# Altium schematic sheet word clock.SchDoc
size 533 x 457 mm
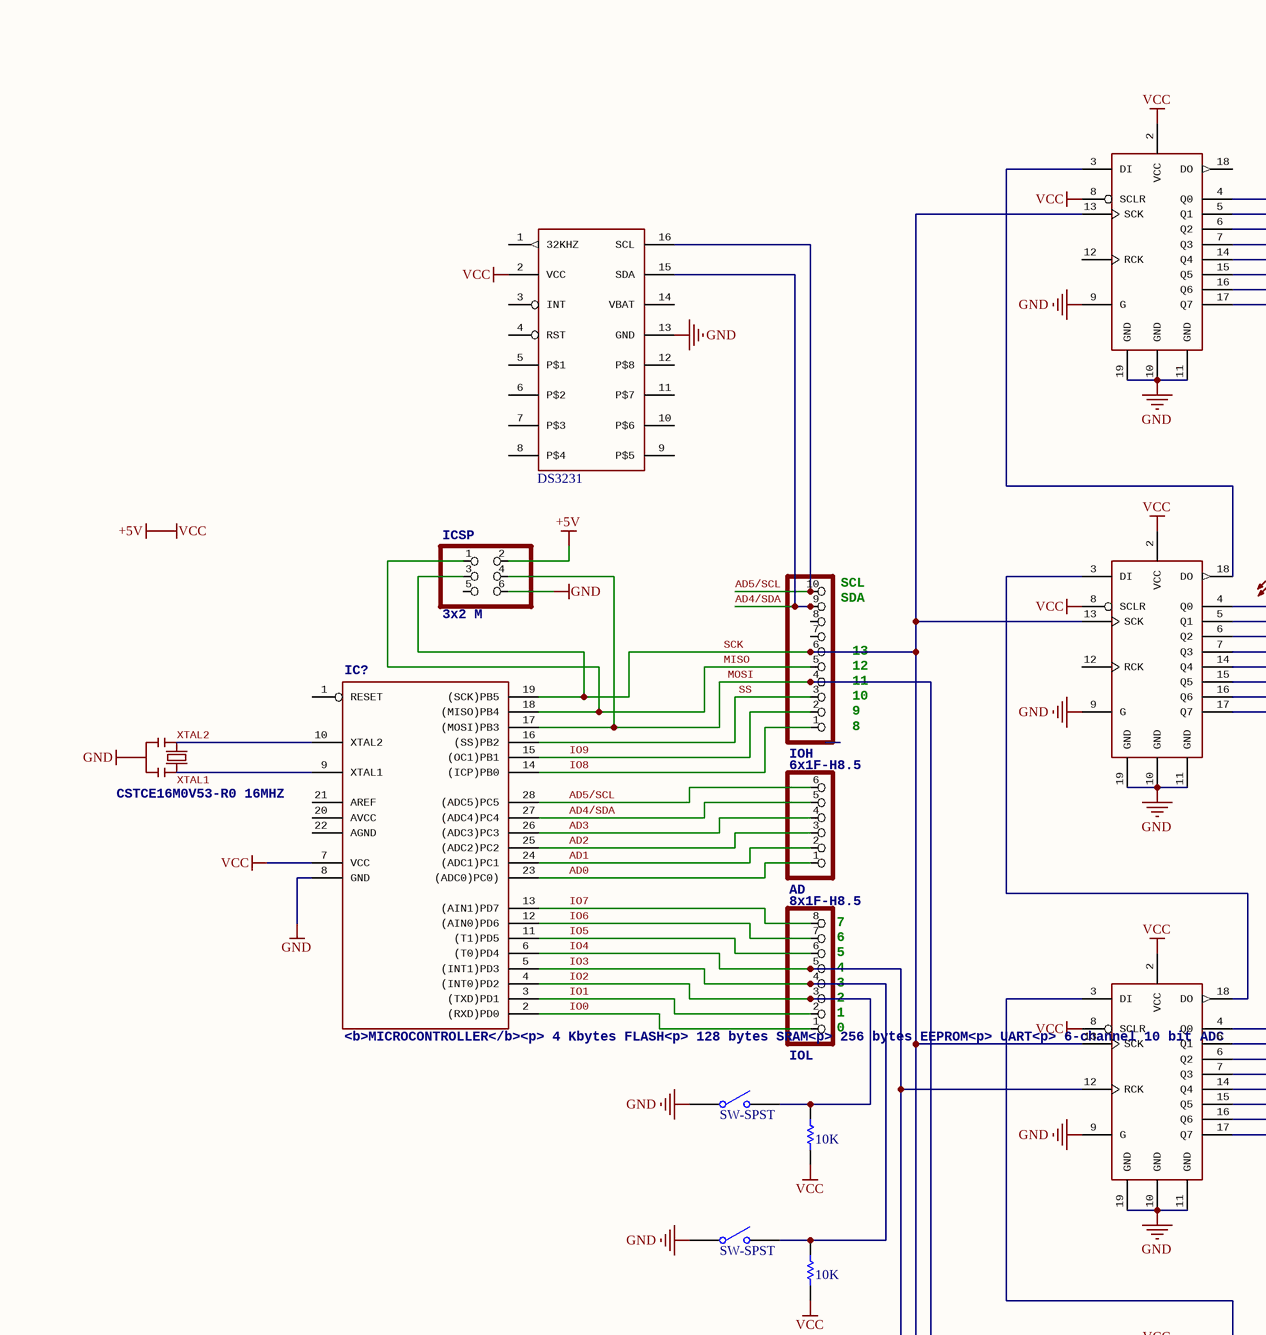
[diagram p0: word clock.SchDoc, top left]
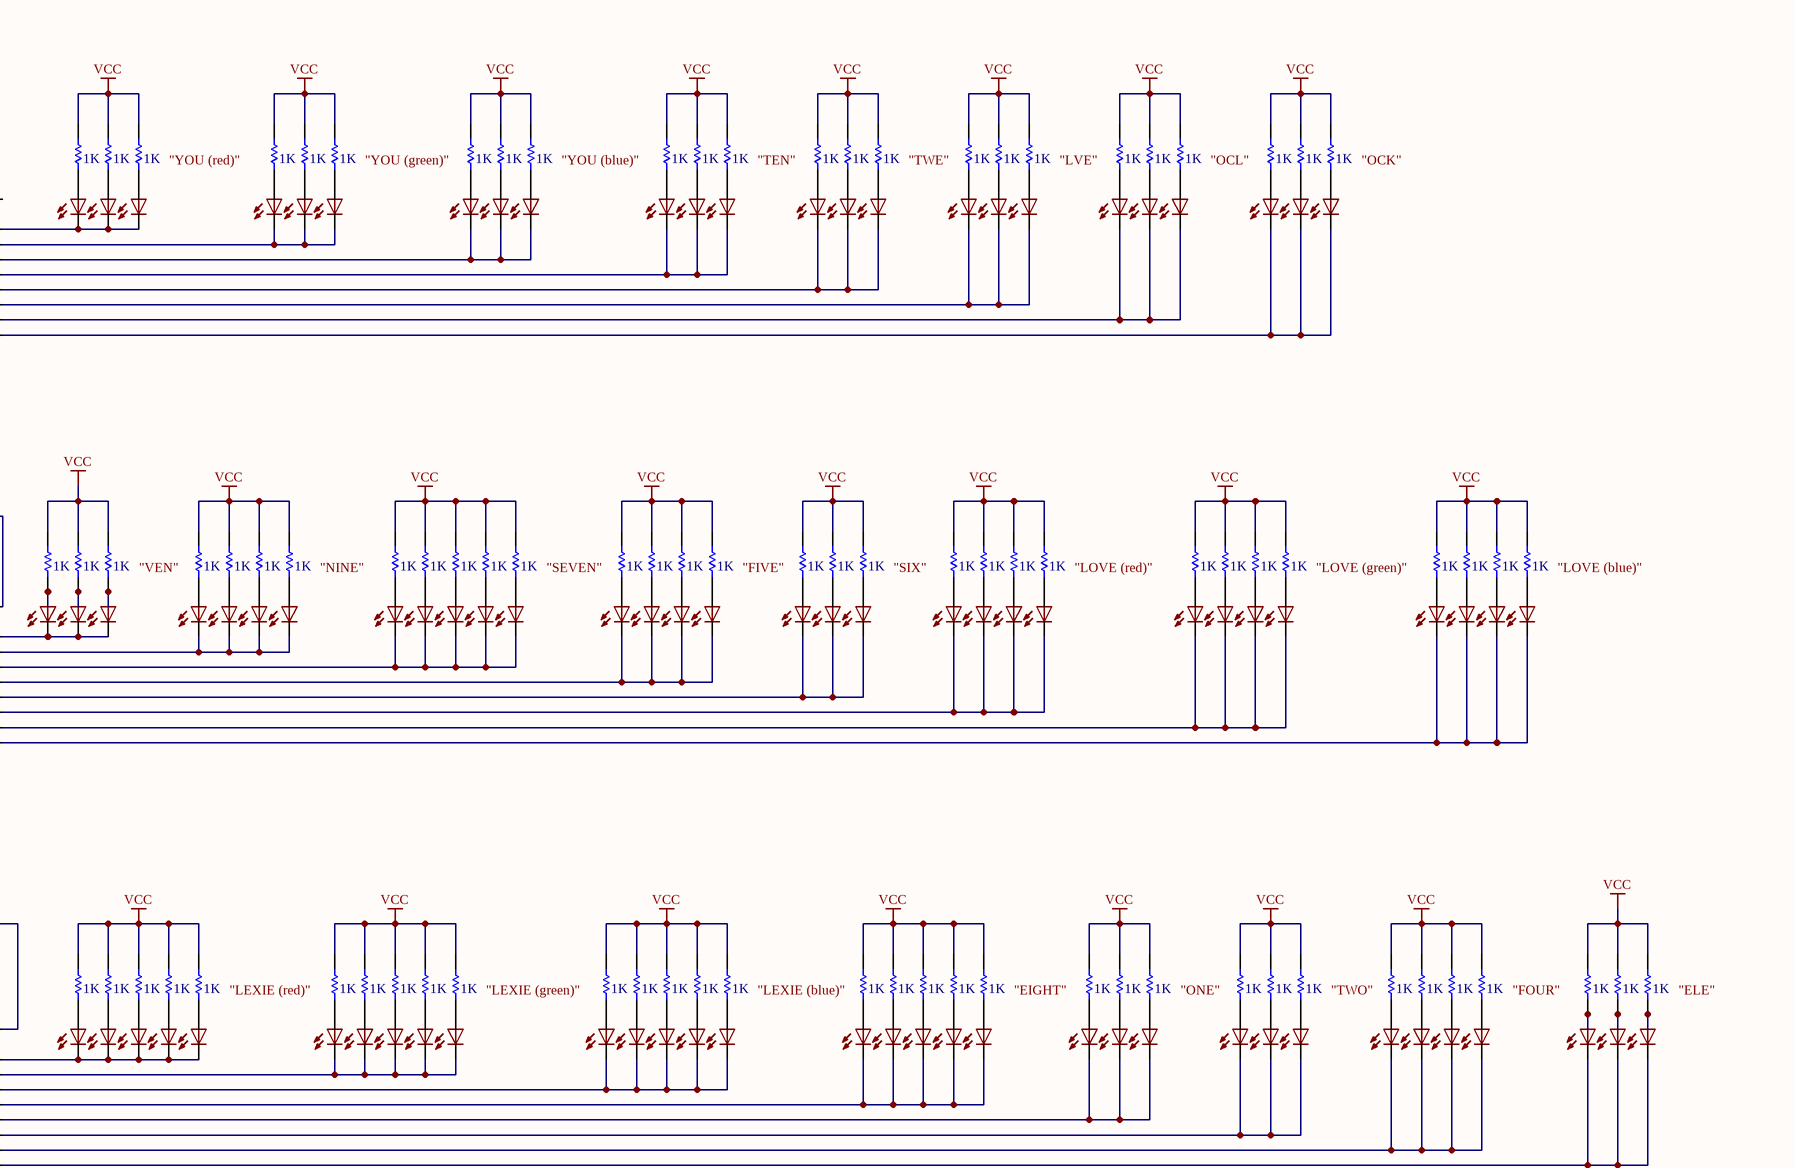
[diagram p1: word clock.SchDoc, top right]
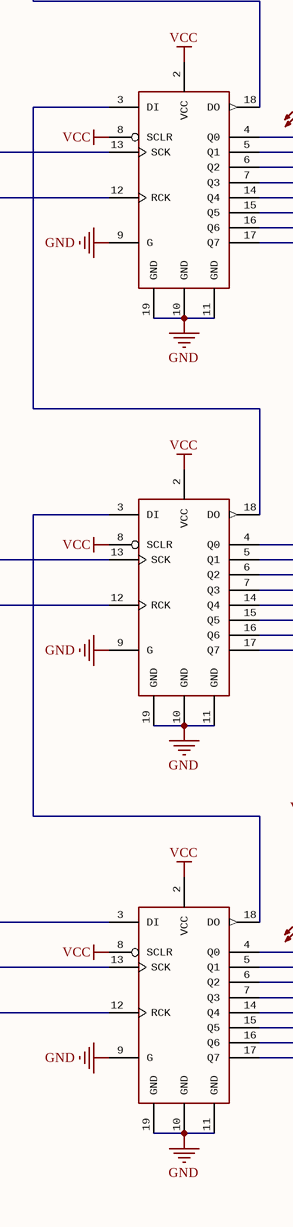
[diagram p2: word clock.SchDoc, bottom left]
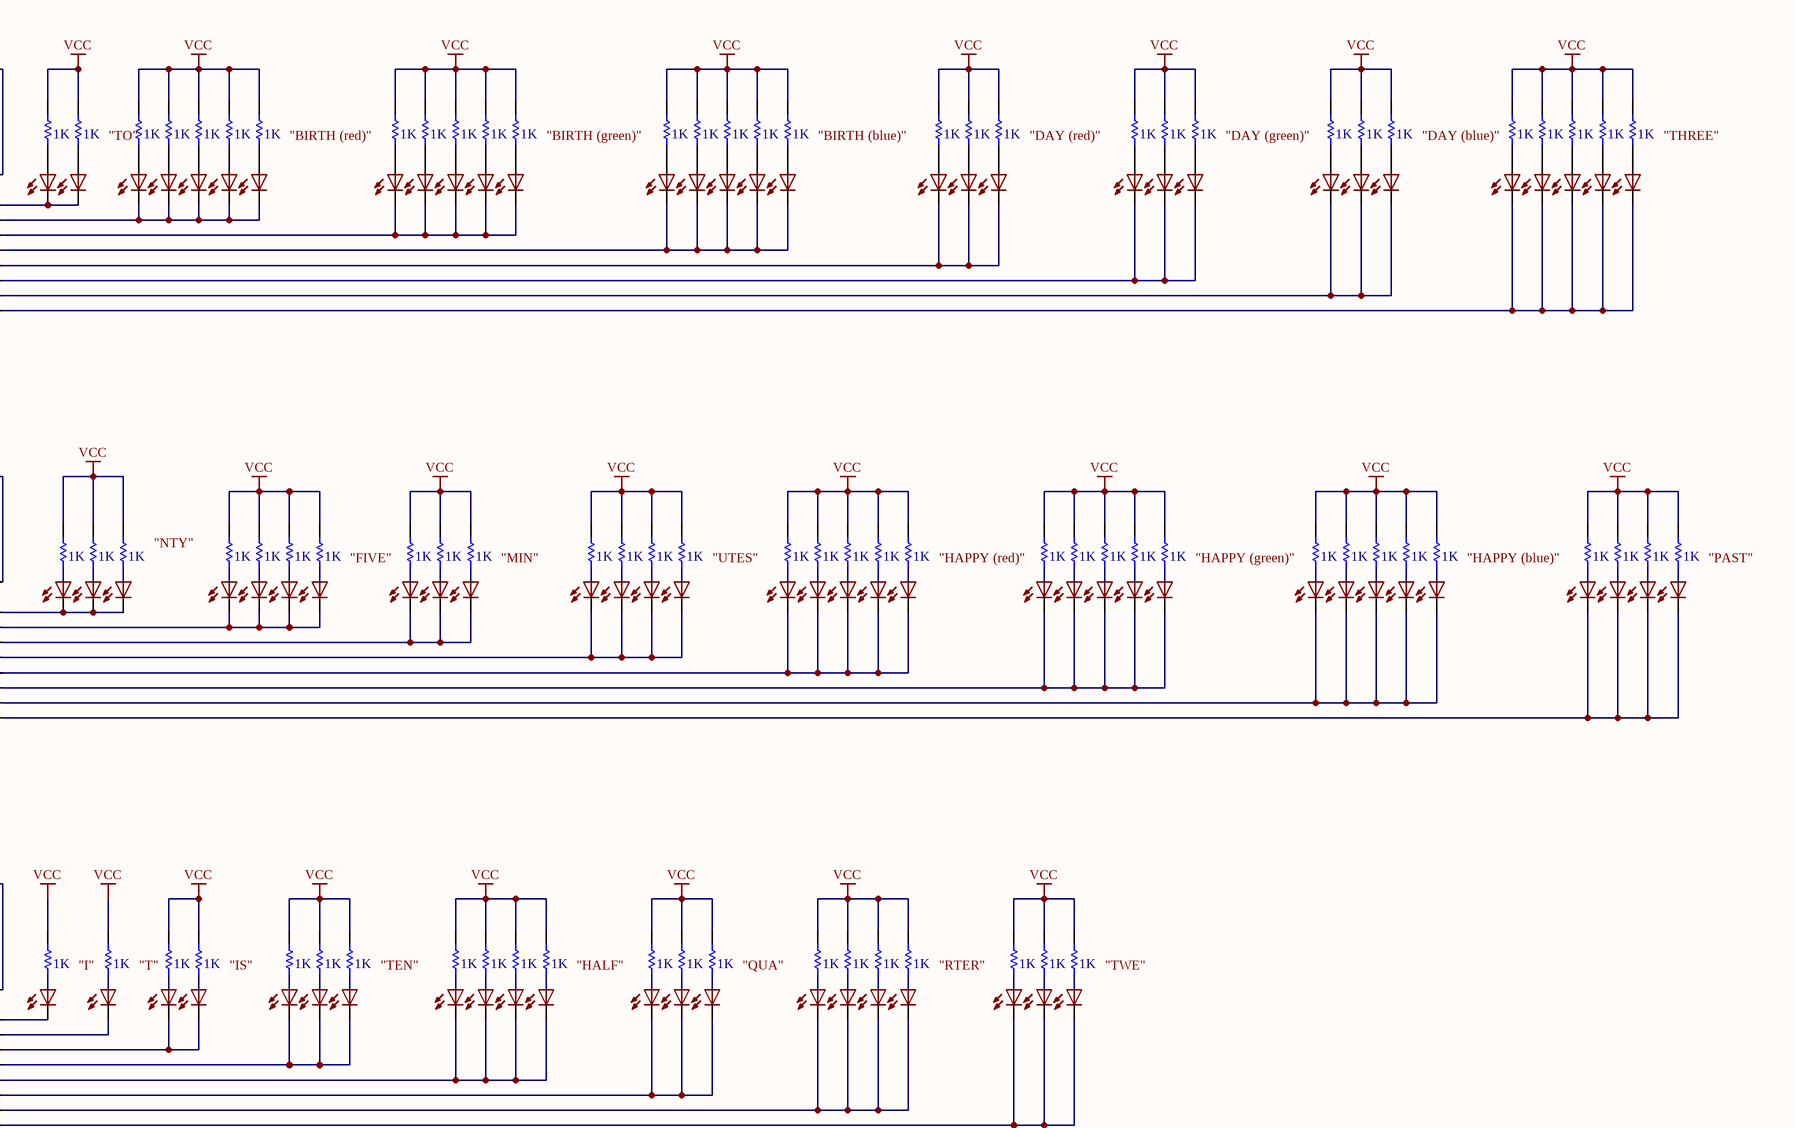
[diagram p3: word clock.SchDoc, bottom right]

## Parts
(Parts that share a designator on the sheet are numbered #1, #2 ... from top to bottom, then left to right.)
?  DS3231  [SO16]
AD  6x1F-H8.5  [1X06]
IC?#1  TPIC6B596N  [DIL20]  (value not drawn)
IC?#2  TPIC6B596N  [DIL20]  (value not drawn)
IC?#3  <b>MICROCONTROLLER</b><p> / 4 Kbytes FLASH<p> / 128 bytes SRAM<p> / 256 bytes EEPROM<p> / UART<p> / 6-channel 10 bit ADC  [DIL28-3]
IC?#4  TPIC6B596N  [DIL20]  (value not drawn)
IC?#5  TPIC6B596N  [DIL20]  (value not drawn)
IC?#6  TPIC6B596N  [DIL20]  (value not drawn)
IC?#7  TPIC6B596N  [DIL20]  (value not drawn)
ICSP  3x2 M  [2X03]
IOH  10x1F-H8.5  [1X10]  (value not drawn)
IOL  8x1F-H8.5  [1X08]
LED  LED5MM  [LED5MM]  (value not drawn)
LED?#1  LED5MM  [LED5MM]  (value not drawn)
LED?#2  LED5MM  [LED5MM]  (value not drawn)
LED?#3  LED5MM  [LED5MM]  (value not drawn)
LED?#4  LED5MM  [LED5MM]  (value not drawn)
LED?#5  LED5MM  [LED5MM]  (value not drawn)
LED?#6  LED5MM  [LED5MM]  (value not drawn)
LED?#7  LED5MM  [LED5MM]  (value not drawn)
LED?#8  LED5MM  [LED5MM]  (value not drawn)
LED?#9  LED5MM  [LED5MM]  (value not drawn)
LED?#10  LED5MM  [LED5MM]  (value not drawn)
LED?#11  LED5MM  [LED5MM]  (value not drawn)
LED?#12  LED5MM  [LED5MM]  (value not drawn)
LED?#13  LED5MM  [LED5MM]  (value not drawn)
LED?#14  LED5MM  [LED5MM]  (value not drawn)
LED?#15  LED5MM  [LED5MM]  (value not drawn)
LED?#16  LED5MM  [LED5MM]  (value not drawn)
LED?#17  LED5MM  [LED5MM]  (value not drawn)
LED?#18  LED5MM  [LED5MM]  (value not drawn)
LED?#19  LED5MM  [LED5MM]  (value not drawn)
LED?#20  LED5MM  [LED5MM]  (value not drawn)
LED?#21  LED5MM  [LED5MM]  (value not drawn)
LED?#22  LED5MM  [LED5MM]  (value not drawn)
LED?#23  LED5MM  [LED5MM]  (value not drawn)
LED?#24  LED5MM  [LED5MM]  (value not drawn)
LED?#25  LED5MM  [LED5MM]  (value not drawn)
LED?#26  LED5MM  [LED5MM]  (value not drawn)
LED?#27  LED5MM  [LED5MM]  (value not drawn)
LED?#28  LED5MM  [LED5MM]  (value not drawn)
LED?#29  LED5MM  [LED5MM]  (value not drawn)
LED?#30  LED5MM  [LED5MM]  (value not drawn)
LED?#31  LED5MM  [LED5MM]  (value not drawn)
LED?#32  LED5MM  [LED5MM]  (value not drawn)
LED?#33  LED5MM  [LED5MM]  (value not drawn)
LED?#34  LED5MM  [LED5MM]  (value not drawn)
LED?#35  LED5MM  [LED5MM]  (value not drawn)
LED?#36  LED5MM  [LED5MM]  (value not drawn)
LED?#37  LED5MM  [LED5MM]  (value not drawn)
LED?#38  LED5MM  [LED5MM]  (value not drawn)
LED?#39  LED5MM  [LED5MM]  (value not drawn)
LED?#40  LED5MM  [LED5MM]  (value not drawn)
LED?#41  LED5MM  [LED5MM]  (value not drawn)
LED?#42  LED5MM  [LED5MM]  (value not drawn)
LED?#43  LED5MM  [LED5MM]  (value not drawn)
LED?#44  LED5MM  [LED5MM]  (value not drawn)
LED?#45  LED5MM  [LED5MM]  (value not drawn)
LED?#46  LED5MM  [LED5MM]  (value not drawn)
LED?#47  LED5MM  [LED5MM]  (value not drawn)
LED?#48  LED5MM  [LED5MM]  (value not drawn)
LED?#49  LED5MM  [LED5MM]  (value not drawn)
LED?#50  LED5MM  [LED5MM]  (value not drawn)
LED?#51  LED5MM  [LED5MM]  (value not drawn)
LED?#52  LED5MM  [LED5MM]  (value not drawn)
LED?#53  LED5MM  [LED5MM]  (value not drawn)
LED?#54  LED5MM  [LED5MM]  (value not drawn)
LED?#55  LED5MM  [LED5MM]  (value not drawn)
LED?#56  LED5MM  [LED5MM]  (value not drawn)
LED?#57  LED5MM  [LED5MM]  (value not drawn)
LED?#58  LED5MM  [LED5MM]  (value not drawn)
LED?#59  LED5MM  [LED5MM]  (value not drawn)
LED?#60  LED5MM  [LED5MM]  (value not drawn)
LED?#61  LED5MM  [LED5MM]  (value not drawn)
LED?#62  LED5MM  [LED5MM]  (value not drawn)
LED?#63  LED5MM  [LED5MM]  (value not drawn)
LED?#64  LED5MM  [LED5MM]  (value not drawn)
LED?#65  LED5MM  [LED5MM]  (value not drawn)
LED?#66  LED5MM  [LED5MM]  (value not drawn)
LED?#67  LED5MM  [LED5MM]  (value not drawn)
LED?#68  LED5MM  [LED5MM]  (value not drawn)
LED?#69  LED5MM  [LED5MM]  (value not drawn)
LED?#70  LED5MM  [LED5MM]  (value not drawn)
LED?#71  LED5MM  [LED5MM]  (value not drawn)
LED?#72  LED5MM  [LED5MM]  (value not drawn)
LED?#73  LED5MM  [LED5MM]  (value not drawn)
LED?#74  LED5MM  [LED5MM]  (value not drawn)
LED?#75  LED5MM  [LED5MM]  (value not drawn)
LED?#76  LED5MM  [LED5MM]  (value not drawn)
LED?#77  LED5MM  [LED5MM]  (value not drawn)
LED?#78  LED5MM  [LED5MM]  (value not drawn)
LED?#79  LED5MM  [LED5MM]  (value not drawn)
LED?#80  LED5MM  [LED5MM]  (value not drawn)
LED?#81  LED5MM  [LED5MM]  (value not drawn)
LED?#82  LED5MM  [LED5MM]  (value not drawn)
LED?#83  LED5MM  [LED5MM]  (value not drawn)
LED?#84  LED5MM  [LED5MM]  (value not drawn)
LED?#85  LED5MM  [LED5MM]  (value not drawn)
LED?#86  LED5MM  [LED5MM]  (value not drawn)
LED?#87  LED5MM  [LED5MM]  (value not drawn)
LED?#88  LED5MM  [LED5MM]  (value not drawn)
LED?#89  LED5MM  [LED5MM]  (value not drawn)
LED?#90  LED5MM  [LED5MM]  (value not drawn)
LED?#91  LED5MM  [LED5MM]  (value not drawn)
LED?#92  LED5MM  [LED5MM]  (value not drawn)
LED?#93  LED5MM  [LED5MM]  (value not drawn)
LED?#94  LED5MM  [LED5MM]  (value not drawn)
LED?#95  LED5MM  [LED5MM]  (value not drawn)
LED?#96  LED5MM  [LED5MM]  (value not drawn)
LED?#97  LED5MM  [LED5MM]  (value not drawn)
LED?#98  LED5MM  [LED5MM]  (value not drawn)
LED?#99  LED5MM  [LED5MM]  (value not drawn)
LED?#100  LED5MM  [LED5MM]  (value not drawn)
LED?#101  LED5MM  [LED5MM]  (value not drawn)
LED?#102  LED5MM  [LED5MM]  (value not drawn)
LED?#103  LED5MM  [LED5MM]  (value not drawn)
LED?#104  LED5MM  [LED5MM]  (value not drawn)
LED?#105  LED5MM  [LED5MM]  (value not drawn)
LED?#106  LED5MM  [LED5MM]  (value not drawn)
LED?#107  LED5MM  [LED5MM]  (value not drawn)
LED?#108  LED5MM  [LED5MM]  (value not drawn)
LED?#109  LED5MM  [LED5MM]  (value not drawn)
LED?#110  LED5MM  [LED5MM]  (value not drawn)
LED?#111  LED5MM  [LED5MM]  (value not drawn)
LED?#112  LED5MM  [LED5MM]  (value not drawn)
LED?#113  LED5MM  [LED5MM]  (value not drawn)
LED?#114  LED5MM  [LED5MM]  (value not drawn)
LED?#115  LED5MM  [LED5MM]  (value not drawn)
LED?#116  LED5MM  [LED5MM]  (value not drawn)
LED?#117  LED5MM  [LED5MM]  (value not drawn)
LED?#118  LED5MM  [LED5MM]  (value not drawn)
LED?#119  LED5MM  [LED5MM]  (value not drawn)
LED?#120  LED5MM  [LED5MM]  (value not drawn)
LED?#121  LED5MM  [LED5MM]  (value not drawn)
LED?#122  LED5MM  [LED5MM]  (value not drawn)
LED?#123  LED5MM  [LED5MM]  (value not drawn)
LED?#124  LED5MM  [LED5MM]  (value not drawn)
LED?#125  LED5MM  [LED5MM]  (value not drawn)
LED?#126  LED5MM  [LED5MM]  (value not drawn)
LED?#127  LED5MM  [LED5MM]  (value not drawn)
LED?#128  LED5MM  [LED5MM]  (value not drawn)
LED?#129  LED5MM  [LED5MM]  (value not drawn)
LED?#130  LED5MM  [LED5MM]  (value not drawn)
LED?#131  LED5MM  [LED5MM]  (value not drawn)
LED?#132  LED5MM  [LED5MM]  (value not drawn)
LED?#133  LED5MM  [LED5MM]  (value not drawn)
LED?#134  LED5MM  [LED5MM]  (value not drawn)
LED?#135  LED5MM  [LED5MM]  (value not drawn)
LED?#136  LED5MM  [LED5MM]  (value not drawn)
LED?#137  LED5MM  [LED5MM]  (value not drawn)
LED?#138  LED5MM  [LED5MM]  (value not drawn)
LED?#139  LED5MM  [LED5MM]  (value not drawn)
LED?#140  LED5MM  [LED5MM]  (value not drawn)
LED?#141  LED5MM  [LED5MM]  (value not drawn)
LED?#142  LED5MM  [LED5MM]  (value not drawn)
LED?#143  LED5MM  [LED5MM]  (value not drawn)
LED?#144  LED5MM  [LED5MM]  (value not drawn)
LED?#145  LED5MM  [LED5MM]  (value not drawn)
LED?#146  LED5MM  [LED5MM]  (value not drawn)
LED?#147  LED5MM  [LED5MM]  (value not drawn)
LED?#148  LED5MM  [LED5MM]  (value not drawn)
LED?#149  LED5MM  [LED5MM]  (value not drawn)
LED?#150  LED5MM  [LED5MM]  (value not drawn)
LED?#151  LED5MM  [LED5MM]  (value not drawn)
LED?#152  LED5MM  [LED5MM]  (value not drawn)
LED?#153  LED5MM  [LED5MM]  (value not drawn)
LED?#154  LED5MM  [LED5MM]  (value not drawn)
LED?#155  LED5MM  [LED5MM]  (value not drawn)
LED?#156  LED5MM  [LED5MM]  (value not drawn)
LED?#157  LED5MM  [LED5MM]  (value not drawn)
LED?#158  LED5MM  [LED5MM]  (value not drawn)
LED?#159  LED5MM  [LED5MM]  (value not drawn)
LED?#160  LED5MM  [LED5MM]  (value not drawn)
LED?#161  LED5MM  [LED5MM]  (value not drawn)
LED?#162  LED5MM  [LED5MM]  (value not drawn)
LED?#163  LED5MM  [LED5MM]  (value not drawn)
LED?#164  LED5MM  [LED5MM]  (value not drawn)
LED?#165  LED5MM  [LED5MM]  (value not drawn)
LED?#166  LED5MM  [LED5MM]  (value not drawn)
LED?#167  LED5MM  [LED5MM]  (value not drawn)
LED?#168  LED5MM  [LED5MM]  (value not drawn)
LED?#169  LED5MM  [LED5MM]  (value not drawn)
LED?#170  LED5MM  [LED5MM]  (value not drawn)
LED?#171  LED5MM  [LED5MM]  (value not drawn)
LED?#172  LED5MM  [LED5MM]  (value not drawn)
R?#1  value 1K  [AXIAL-0.3]  (hidden comment: Res1)
R?#2  value 1K  [AXIAL-0.3]  (hidden comment: Res1)
R?#3  value 1K  [AXIAL-0.3]  (hidden comment: Res1)
R?#4  value 1K  [AXIAL-0.3]  (hidden comment: Res1)
R?#5  value 1K  [AXIAL-0.3]  (hidden comment: Res1)
R?#6  value 1K  [AXIAL-0.3]  (hidden comment: Res1)
R?#7  value 1K  [AXIAL-0.3]  (hidden comment: Res1)
R?#8  value 1K  [AXIAL-0.3]  (hidden comment: Res1)
R?#9  value 1K  [AXIAL-0.3]  (hidden comment: Res1)
R?#10  value 1K  [AXIAL-0.3]  (hidden comment: Res1)
R?#11  value 1K  [AXIAL-0.3]  (hidden comment: Res1)
R?#12  value 1K  [AXIAL-0.3]  (hidden comment: Res1)
R?#13  value 1K  [AXIAL-0.3]  (hidden comment: Res1)
R?#14  value 1K  [AXIAL-0.3]  (hidden comment: Res1)
R?#15  value 1K  [AXIAL-0.3]  (hidden comment: Res1)
R?#16  value 1K  [AXIAL-0.3]  (hidden comment: Res1)
R?#17  value 1K  [AXIAL-0.3]  (hidden comment: Res1)
R?#18  value 1K  [AXIAL-0.3]  (hidden comment: Res1)
R?#19  value 1K  [AXIAL-0.3]  (hidden comment: Res1)
R?#20  value 1K  [AXIAL-0.3]  (hidden comment: Res1)
R?#21  value 1K  [AXIAL-0.3]  (hidden comment: Res1)
R?#22  value 1K  [AXIAL-0.3]  (hidden comment: Res1)
R?#23  value 1K  [AXIAL-0.3]  (hidden comment: Res1)
R?#24  value 1K  [AXIAL-0.3]  (hidden comment: Res1)
R?#25  value 1K  [AXIAL-0.3]  (hidden comment: Res1)
R?#26  value 1K  [AXIAL-0.3]  (hidden comment: Res1)
R?#27  value 1K  [AXIAL-0.3]  (hidden comment: Res1)
R?#28  value 1K  [AXIAL-0.3]  (hidden comment: Res1)
R?#29  value 1K  [AXIAL-0.3]  (hidden comment: Res1)
R?#30  value 1K  [AXIAL-0.3]  (hidden comment: Res1)
R?#31  value 1K  [AXIAL-0.3]  (hidden comment: Res1)
R?#32  value 1K  [AXIAL-0.3]  (hidden comment: Res1)
R?#33  value 1K  [AXIAL-0.3]  (hidden comment: Res1)
R?#34  value 1K  [AXIAL-0.3]  (hidden comment: Res1)
R?#35  value 1K  [AXIAL-0.3]  (hidden comment: Res1)
R?#36  value 1K  [AXIAL-0.3]  (hidden comment: Res1)
R?#37  value 1K  [AXIAL-0.3]  (hidden comment: Res1)
R?#38  value 1K  [AXIAL-0.3]  (hidden comment: Res1)
R?#39  value 1K  [AXIAL-0.3]  (hidden comment: Res1)
R?#40  value 1K  [AXIAL-0.3]  (hidden comment: Res1)
R?#41  value 1K  [AXIAL-0.3]  (hidden comment: Res1)
R?#42  value 1K  [AXIAL-0.3]  (hidden comment: Res1)
R?#43  value 1K  [AXIAL-0.3]  (hidden comment: Res1)
R?#44  value 1K  [AXIAL-0.3]  (hidden comment: Res1)
R?#45  value 1K  [AXIAL-0.3]  (hidden comment: Res1)
R?#46  value 1K  [AXIAL-0.3]  (hidden comment: Res1)
R?#47  value 1K  [AXIAL-0.3]  (hidden comment: Res1)
R?#48  value 1K  [AXIAL-0.3]  (hidden comment: Res1)
R?#49  value 1K  [AXIAL-0.3]  (hidden comment: Res1)
R?#50  value 1K  [AXIAL-0.3]  (hidden comment: Res1)
R?#51  value 1K  [AXIAL-0.3]  (hidden comment: Res1)
R?#52  value 1K  [AXIAL-0.3]  (hidden comment: Res1)
R?#53  value 1K  [AXIAL-0.3]  (hidden comment: Res1)
R?#54  value 1K  [AXIAL-0.3]  (hidden comment: Res1)
R?#55  value 1K  [AXIAL-0.3]  (hidden comment: Res1)
R?#56  value 1K  [AXIAL-0.3]  (hidden comment: Res1)
R?#57  value 1K  [AXIAL-0.3]  (hidden comment: Res1)
R?#58  value 1K  [AXIAL-0.3]  (hidden comment: Res1)
R?#59  value 1K  [AXIAL-0.3]  (hidden comment: Res1)
R?#60  value 1K  [AXIAL-0.3]  (hidden comment: Res1)
R?#61  value 1K  [AXIAL-0.3]  (hidden comment: Res1)
R?#62  value 1K  [AXIAL-0.3]  (hidden comment: Res1)
R?#63  value 1K  [AXIAL-0.3]  (hidden comment: Res1)
R?#64  value 1K  [AXIAL-0.3]  (hidden comment: Res1)
R?#65  value 1K  [AXIAL-0.3]  (hidden comment: Res1)
R?#66  value 1K  [AXIAL-0.3]  (hidden comment: Res1)
R?#67  value 1K  [AXIAL-0.3]  (hidden comment: Res1)
R?#68  value 1K  [AXIAL-0.3]  (hidden comment: Res1)
R?#69  value 1K  [AXIAL-0.3]  (hidden comment: Res1)
R?#70  value 1K  [AXIAL-0.3]  (hidden comment: Res1)
R?#71  value 1K  [AXIAL-0.3]  (hidden comment: Res1)
R?#72  value 1K  [AXIAL-0.3]  (hidden comment: Res1)
R?#73  value 1K  [AXIAL-0.3]  (hidden comment: Res1)
R?#74  value 1K  [AXIAL-0.3]  (hidden comment: Res1)
R?#75  value 1K  [AXIAL-0.3]  (hidden comment: Res1)
R?#76  value 1K  [AXIAL-0.3]  (hidden comment: Res1)
R?#77  value 1K  [AXIAL-0.3]  (hidden comment: Res1)
R?#78  value 1K  [AXIAL-0.3]  (hidden comment: Res1)
R?#79  value 1K  [AXIAL-0.3]  (hidden comment: Res1)
R?#80  value 1K  [AXIAL-0.3]  (hidden comment: Res1)
R?#81  value 1K  [AXIAL-0.3]  (hidden comment: Res1)
R?#82  value 1K  [AXIAL-0.3]  (hidden comment: Res1)
R?#83  value 1K  [AXIAL-0.3]  (hidden comment: Res1)
R?#84  value 1K  [AXIAL-0.3]  (hidden comment: Res1)
R?#85  value 1K  [AXIAL-0.3]  (hidden comment: Res1)
R?#86  value 1K  [AXIAL-0.3]  (hidden comment: Res1)
R?#87  value 1K  [AXIAL-0.3]  (hidden comment: Res1)
R?#88  value 1K  [AXIAL-0.3]  (hidden comment: Res1)
R?#89  value 10K  [AXIAL-0.3]  (hidden comment: Res1)
R?#90  value 10K  [AXIAL-0.3]  (hidden comment: Res1)
R?#91  value 1K  [AXIAL-0.3]  (hidden comment: Res1)
R?#92  value 1K  [AXIAL-0.3]  (hidden comment: Res1)
R?#93  value 1K  [AXIAL-0.3]  (hidden comment: Res1)
R?#94  value 1K  [AXIAL-0.3]  (hidden comment: Res1)
R?#95  value 1K  [AXIAL-0.3]  (hidden comment: Res1)
R?#96  value 1K  [AXIAL-0.3]  (hidden comment: Res1)
R?#97  value 1K  [AXIAL-0.3]  (hidden comment: Res1)
R?#98  value 1K  [AXIAL-0.3]  (hidden comment: Res1)
R?#99  value 1K  [AXIAL-0.3]  (hidden comment: Res1)
R?#100  value 1K  [AXIAL-0.3]  (hidden comment: Res1)
R?#101  value 1K  [AXIAL-0.3]  (hidden comment: Res1)
R?#102  value 1K  [AXIAL-0.3]  (hidden comment: Res1)
R?#103  value 1K  [AXIAL-0.3]  (hidden comment: Res1)
R?#104  value 1K  [AXIAL-0.3]  (hidden comment: Res1)
R?#105  value 1K  [AXIAL-0.3]  (hidden comment: Res1)
R?#106  value 1K  [AXIAL-0.3]  (hidden comment: Res1)
R?#107  value 1K  [AXIAL-0.3]  (hidden comment: Res1)
R?#108  value 1K  [AXIAL-0.3]  (hidden comment: Res1)
R?#109  value 1K  [AXIAL-0.3]  (hidden comment: Res1)
R?#110  value 1K  [AXIAL-0.3]  (hidden comment: Res1)
R?#111  value 1K  [AXIAL-0.3]  (hidden comment: Res1)
R?#112  value 1K  [AXIAL-0.3]  (hidden comment: Res1)
R?#113  value 1K  [AXIAL-0.3]  (hidden comment: Res1)
R?#114  value 1K  [AXIAL-0.3]  (hidden comment: Res1)
R?#115  value 1K  [AXIAL-0.3]  (hidden comment: Res1)
R?#116  value 1K  [AXIAL-0.3]  (hidden comment: Res1)
R?#117  value 1K  [AXIAL-0.3]  (hidden comment: Res1)
R?#118  value 1K  [AXIAL-0.3]  (hidden comment: Res1)
R?#119  value 1K  [AXIAL-0.3]  (hidden comment: Res1)
R?#120  value 1K  [AXIAL-0.3]  (hidden comment: Res1)
R?#121  value 1K  [AXIAL-0.3]  (hidden comment: Res1)
R?#122  value 1K  [AXIAL-0.3]  (hidden comment: Res1)
R?#123  value 1K  [AXIAL-0.3]  (hidden comment: Res1)
R?#124  value 1K  [AXIAL-0.3]  (hidden comment: Res1)
R?#125  value 1K  [AXIAL-0.3]  (hidden comment: Res1)
R?#126  value 1K  [AXIAL-0.3]  (hidden comment: Res1)
R?#127  value 1K  [AXIAL-0.3]  (hidden comment: Res1)
R?#128  value 1K  [AXIAL-0.3]  (hidden comment: Res1)
R?#129  value 1K  [AXIAL-0.3]  (hidden comment: Res1)
R?#130  value 1K  [AXIAL-0.3]  (hidden comment: Res1)
R?#131  value 1K  [AXIAL-0.3]  (hidden comment: Res1)
R?#132  value 1K  [AXIAL-0.3]  (hidden comment: Res1)
R?#133  value 1K  [AXIAL-0.3]  (hidden comment: Res1)
R?#134  value 1K  [AXIAL-0.3]  (hidden comment: Res1)
R?#135  value 1K  [AXIAL-0.3]  (hidden comment: Res1)
R?#136  value 1K  [AXIAL-0.3]  (hidden comment: Res1)
R?#137  value 1K  [AXIAL-0.3]  (hidden comment: Res1)
R?#138  value 1K  [AXIAL-0.3]  (hidden comment: Res1)
R?#139  value 1K  [AXIAL-0.3]  (hidden comment: Res1)
R?#140  value 1K  [AXIAL-0.3]  (hidden comment: Res1)
R?#141  value 1K  [AXIAL-0.3]  (hidden comment: Res1)
R?#142  value 1K  [AXIAL-0.3]  (hidden comment: Res1)
R?#143  value 1K  [AXIAL-0.3]  (hidden comment: Res1)
R?#144  value 1K  [AXIAL-0.3]  (hidden comment: Res1)
R?#145  value 1K  [AXIAL-0.3]  (hidden comment: Res1)
R?#146  value 1K  [AXIAL-0.3]  (hidden comment: Res1)
R?#147  value 1K  [AXIAL-0.3]  (hidden comment: Res1)
R?#148  value 1K  [AXIAL-0.3]  (hidden comment: Res1)
R?#149  value 1K  [AXIAL-0.3]  (hidden comment: Res1)
R?#150  value 1K  [AXIAL-0.3]  (hidden comment: Res1)
R?#151  value 1K  [AXIAL-0.3]  (hidden comment: Res1)
R?#152  value 1K  [AXIAL-0.3]  (hidden comment: Res1)
R?#153  value 1K  [AXIAL-0.3]  (hidden comment: Res1)
R?#154  value 1K  [AXIAL-0.3]  (hidden comment: Res1)
R?#155  value 1K  [AXIAL-0.3]  (hidden comment: Res1)
R?#156  value 1K  [AXIAL-0.3]  (hidden comment: Res1)
R?#157  value 1K  [AXIAL-0.3]  (hidden comment: Res1)
R?#158  value 1K  [AXIAL-0.3]  (hidden comment: Res1)
R?#159  value 1K  [AXIAL-0.3]  (hidden comment: Res1)
R?#160  value 1K  [AXIAL-0.3]  (hidden comment: Res1)
R?#161  value 1K  [AXIAL-0.3]  (hidden comment: Res1)
R?#162  value 1K  [AXIAL-0.3]  (hidden comment: Res1)
R?#163  value 1K  [AXIAL-0.3]  (hidden comment: Res1)
R?#164  value 1K  [AXIAL-0.3]  (hidden comment: Res1)
R?#165  value 1K  [AXIAL-0.3]  (hidden comment: Res1)
R?#166  value 1K  [AXIAL-0.3]  (hidden comment: Res1)
R?#167  value 1K  [AXIAL-0.3]  (hidden comment: Res1)
R?#168  value 1K  [AXIAL-0.3]  (hidden comment: Res1)
R?#169  value 1K  [AXIAL-0.3]  (hidden comment: Res1)
R?#170  value 1K  [AXIAL-0.3]  (hidden comment: Res1)
R?#171  value 1K  [AXIAL-0.3]  (hidden comment: Res1)
R?#172  value 1K  [AXIAL-0.3]  (hidden comment: Res1)
R?#173  value 1K  [AXIAL-0.3]  (hidden comment: Res1)
R?#174  value 1K  [AXIAL-0.3]  (hidden comment: Res1)
R?#175  value 1K  [AXIAL-0.3]  (hidden comment: Res1)
S?#1  SW-SPST  [SPST-2]
S?#2  SW-SPST  [SPST-2]
Y2  CSTCE16M0V53-R0 16MHZ  [RESONATOR]

## Nets
+5V: ?.2(VCC) IC?#1.2(VCC) IC?#1.8(SCLR) IC?#2.2(VCC) IC?#2.8(SCLR) IC?#3.7(VCC) IC?#4.2(VCC) IC?#4.8(SCLR) IC?#5.2(VCC) IC?#5.8(SCLR) IC?#6.2(VCC) IC?#6.8(SCLR) IC?#7.2(VCC) IC?#7.8(SCLR) ICSP.2 R?#1.2 R?#2.2 R?#3.2 R?#4.2 R?#5.2 R?#6.2 R?#7.2 R?#8.2 R?#9.2 R?#10.2 R?#11.2 R?#12.2 R?#13.2 R?#14.2 R?#15.2 R?#16.2 R?#17.2 R?#18.2 R?#19.2 R?#20.2 R?#21.2 R?#22.2 R?#23.2 R?#24.2 R?#25.2 R?#26.2 R?#27.2 R?#28.2 R?#29.2 R?#30.2 R?#31.2 R?#32.2 R?#33.2 R?#34.2 R?#35.2 R?#36.2 R?#37.2 R?#38.2 R?#39.2 R?#40.2 R?#41.2 R?#42.2 R?#43.2 R?#44.2 R?#45.2 R?#46.2 R?#47.2 R?#48.2 R?#49.2 R?#50.2 R?#51.2 R?#52.2 R?#53.2 R?#54.2 R?#55.2 R?#56.2 R?#57.2 R?#58.2 R?#59.2 R?#60.2 R?#61.2 R?#62.2 R?#63.2 R?#64.2 R?#65.2 R?#66.2 R?#67.2 R?#68.2 R?#69.2 R?#70.2 R?#71.2 R?#72.2 R?#73.2 R?#74.2 R?#75.2 R?#76.2 R?#77.2 R?#78.2 R?#79.2 R?#80.2 R?#81.2 R?#82.2 R?#83.2 R?#84.2 R?#85.2 R?#86.2 R?#87.2 R?#88.2 R?#89.1 R?#90.1 R?#91.2 R?#92.2 R?#93.2 R?#94.2 R?#95.2 R?#96.2 R?#97.2 R?#98.2 R?#99.2 R?#100.2 R?#101.2 R?#102.2 R?#103.2 R?#104.2 R?#105.2 R?#106.2 R?#107.2 R?#108.2 R?#109.2 R?#110.2 R?#111.2 R?#112.2 R?#113.2 R?#114.2 R?#115.2 R?#116.2 R?#117.2 R?#118.2 R?#119.2 R?#120.2 R?#121.2 R?#122.2 R?#123.2 R?#124.2 R?#125.2 R?#126.2 R?#127.2 R?#128.2 R?#129.2 R?#130.2 R?#131.2 R?#132.2 R?#133.2 R?#134.2 R?#135.2 R?#136.2 R?#137.2 R?#138.2 R?#139.2 R?#140.2 R?#141.2 R?#142.2 R?#143.2 R?#144.2 R?#145.2 R?#146.2 R?#147.2 R?#148.2 R?#149.2 R?#150.2 R?#151.2 R?#152.2 R?#153.2 R?#154.2 R?#155.2 R?#156.2 R?#157.2 R?#158.2 R?#159.2 R?#160.2 R?#161.2 R?#162.2 R?#163.2 R?#164.2 R?#165.2 R?#166.2 R?#167.2 R?#168.2 R?#169.2 R?#170.2 R?#171.2 R?#172.2 R?#173.2 R?#174.2 R?#175.2  [also labelled VCC]
GND: ?.13(GND) IC?#1.9(G) IC?#1.10(GND) IC?#1.11(GND) IC?#1.19(GND) IC?#2.9(G) IC?#2.10(GND) IC?#2.11(GND) IC?#2.19(GND) IC?#3.8(GND) IC?#4.9(G) IC?#4.10(GND) IC?#4.11(GND) IC?#4.19(GND) IC?#5.9(G) IC?#5.10(GND) IC?#5.11(GND) IC?#5.19(GND) IC?#6.9(G) IC?#6.10(GND) IC?#6.11(GND) IC?#6.19(GND) IC?#7.9(G) IC?#7.10(GND) IC?#7.11(GND) IC?#7.19(GND) ICSP.6 S?#1.1(COMMON) S?#2.1(COMMON) Y2.2
AD0: AD.1 IC?#3.23((ADC0)PC0))
AD1: AD.2 IC?#3.24((ADC1)PC1)
AD2: AD.3 IC?#3.25((ADC2)PC2)
AD3: AD.4 IC?#3.26((ADC3)PC3)
AD4/SDA: ?.15(SDA) AD.5 IC?#3.27((ADC4)PC4) IOH.9
AD5/SCL: ?.16(SCL) AD.6 IC?#3.28((ADC5)PC5) IOH.10
IO0: IC?#3.2((RXD)PD0) IOL.1
IO1: IC?#3.3((TXD)PD1) IOL.2
IO2: IC?#3.4((INT0)PD2) IOL.3 R?#89.2 S?#1.2(NO)
IO3: IC?#3.5((INT1)PD3) IOL.4 R?#90.2 S?#2.2(NO)
IO4: IC?#3.6((T0)PD4) IC?#4.12(RCK) IC?#5.12(RCK) IC?#6.12(RCK) IC?#7.12(RCK) IOL.5
IO5: IC?#3.11((T1)PD5) IOL.6
IO6: IC?#3.12((AIN0)PD6) IOL.7
IO7: IC?#3.13((AIN1)PD7) IOL.8
IO8: IC?#3.14((ICP)PB0) IOH.1
IO9: IC?#3.15((OC1)PB1) IOH.2
MISO: IC?#3.18((MISO)PB4) ICSP.1 IOH.5
MOSI: IC?#3.17((MOSI)PB3) IC?#7.3(DI) ICSP.4 IOH.4
SCK: IC?#1.13(SCK) IC?#2.13(SCK) IC?#3.19((SCK)PB5) IC?#4.13(SCK) IC?#5.13(SCK) IC?#6.13(SCK) IC?#7.13(SCK) ICSP.3 IOH.6
SS: IC?#3.16((SS)PB2) IOH.3
XTAL2: IC?#3.10(XTAL2) Y2.1
NetIC?#1_3: IC?#1.3(DI) IC?#2.18(DO)
NetIC?#1_4: IC?#1.4(Q0) LED.K(C) LED?#1.K(C) LED?#2.K(C)
NetIC?#1_5: IC?#1.5(Q1) LED?#3.K(C) LED?#4.K(C) LED?#5.K(C)
NetIC?#1_6: IC?#1.6(Q2) LED?#6.K(C) LED?#7.K(C) LED?#8.K(C)
NetIC?#1_7: IC?#1.7(Q3) LED?#9.K(C) LED?#10.K(C) LED?#11.K(C)
NetIC?#1_14: IC?#1.14(Q4) LED?#12.K(C) LED?#13.K(C) LED?#14.K(C)
NetIC?#1_15: IC?#1.15(Q5) LED?#15.K(C) LED?#16.K(C) LED?#17.K(C)
NetIC?#1_16: IC?#1.16(Q6) LED?#18.K(C) LED?#19.K(C) LED?#20.K(C)
NetIC?#1_17: IC?#1.17(Q7) LED?#21.K(C) LED?#22.K(C) LED?#23.K(C)
NetIC?#2_3: IC?#2.3(DI) IC?#4.18(DO)
NetIC?#2_4: IC?#2.4(Q0) LED?#24.K(C) LED?#25.K(C) LED?#26.K(C)
NetIC?#2_5: IC?#2.5(Q1) LED?#27.K(C) LED?#28.K(C) LED?#29.K(C) LED?#30.K(C)
NetIC?#2_6: IC?#2.6(Q2) LED?#31.K(C) LED?#32.K(C) LED?#33.K(C) LED?#34.K(C) LED?#35.K(C)
NetIC?#2_7: IC?#2.7(Q3) LED?#36.K(C) LED?#37.K(C) LED?#38.K(C) LED?#39.K(C)
NetIC?#2_14: IC?#2.14(Q4) LED?#40.K(C) LED?#41.K(C) LED?#42.K(C)
NetIC?#2_15: IC?#2.15(Q5) LED?#43.K(C) LED?#44.K(C) LED?#45.K(C) LED?#46.K(C)
NetIC?#2_16: IC?#2.16(Q6) LED?#47.K(C) LED?#48.K(C) LED?#49.K(C) LED?#50.K(C)
NetIC?#2_17: IC?#2.17(Q7) LED?#51.K(C) LED?#52.K(C) LED?#53.K(C) LED?#54.K(C)
NetIC?#3_9: IC?#3.9(XTAL1) Y2.3
NetIC?#4_3: IC?#4.3(DI) IC?#5.18(DO)
NetIC?#4_4: IC?#4.4(Q0) LED?#55.K(C) LED?#56.K(C) LED?#57.K(C) LED?#58.K(C) LED?#59.K(C)
NetIC?#4_5: IC?#4.5(Q1) LED?#60.K(C) LED?#61.K(C) LED?#62.K(C) LED?#63.K(C) LED?#64.K(C)
NetIC?#4_6: IC?#4.6(Q2) LED?#65.K(C) LED?#66.K(C) LED?#67.K(C) LED?#68.K(C) LED?#69.K(C)
NetIC?#4_7: IC?#4.7(Q3) LED?#70.K(C) LED?#71.K(C) LED?#72.K(C) LED?#73.K(C) LED?#74.K(C)
NetIC?#4_14: IC?#4.14(Q4) LED?#75.K(C) LED?#76.K(C) LED?#77.K(C)
NetIC?#4_15: IC?#4.15(Q5) LED?#78.K(C) LED?#79.K(C) LED?#80.K(C)
NetIC?#4_16: IC?#4.16(Q6) LED?#81.K(C) LED?#82.K(C) LED?#83.K(C) LED?#84.K(C)
NetIC?#4_17: IC?#4.17(Q7) LED?#85.K(C) LED?#86.K(C) LED?#87.K(C)
NetIC?#5_3: IC?#5.3(DI) IC?#6.18(DO)
NetIC?#5_4: IC?#5.4(Q0) LED?#88.K(C) LED?#89.K(C)
NetIC?#5_5: IC?#5.5(Q1) LED?#90.K(C) LED?#91.K(C) LED?#92.K(C) LED?#93.K(C) LED?#94.K(C)
NetIC?#5_6: IC?#5.6(Q2) LED?#95.K(C) LED?#96.K(C) LED?#97.K(C) LED?#98.K(C) LED?#99.K(C)
NetIC?#5_7: IC?#5.7(Q3) LED?#100.K(C) LED?#101.K(C) LED?#102.K(C) LED?#103.K(C) LED?#104.K(C)
NetIC?#5_14: IC?#5.14(Q4) LED?#105.K(C) LED?#106.K(C) LED?#107.K(C)
NetIC?#5_15: IC?#5.15(Q5) LED?#108.K(C) LED?#109.K(C) LED?#110.K(C)
NetIC?#5_16: IC?#5.16(Q6) LED?#111.K(C) LED?#112.K(C) LED?#113.K(C)
NetIC?#5_17: IC?#5.17(Q7) LED?#114.K(C) LED?#115.K(C) LED?#116.K(C) LED?#117.K(C) LED?#118.K(C)
NetIC?#6_3: IC?#6.3(DI) IC?#7.18(DO)
NetIC?#6_4: IC?#6.4(Q0) LED?#119.K(C) LED?#120.K(C) LED?#121.K(C)
NetIC?#6_5: IC?#6.5(Q1) LED?#122.K(C) LED?#123.K(C) LED?#124.K(C) LED?#125.K(C)
NetIC?#6_6: IC?#6.6(Q2) LED?#126.K(C) LED?#127.K(C) LED?#128.K(C)
NetIC?#6_7: IC?#6.7(Q3) LED?#129.K(C) LED?#130.K(C) LED?#131.K(C) LED?#132.K(C)
NetIC?#6_14: IC?#6.14(Q4) LED?#133.K(C) LED?#134.K(C) LED?#135.K(C) LED?#136.K(C) LED?#137.K(C)
NetIC?#6_15: IC?#6.15(Q5) LED?#138.K(C) LED?#139.K(C) LED?#140.K(C) LED?#141.K(C) LED?#142.K(C)
NetIC?#6_16: IC?#6.16(Q6) LED?#143.K(C) LED?#144.K(C) LED?#145.K(C) LED?#146.K(C) LED?#147.K(C)
NetIC?#6_17: IC?#6.17(Q7) LED?#148.K(C) LED?#149.K(C) LED?#150.K(C) LED?#151.K(C)
NetIC?#7_4: IC?#7.4(Q0) LED?#152.K(C)
NetIC?#7_5: IC?#7.5(Q1) LED?#153.K(C)
NetIC?#7_6: IC?#7.6(Q2) LED?#154.K(C) LED?#155.K(C)
NetIC?#7_7: IC?#7.7(Q3) LED?#156.K(C) LED?#157.K(C) LED?#158.K(C)
NetIC?#7_14: IC?#7.14(Q4) LED?#159.K(C) LED?#160.K(C) LED?#161.K(C) LED?#162.K(C)
NetIC?#7_15: IC?#7.15(Q5) LED?#163.K(C) LED?#164.K(C) LED?#165.K(C)
NetIC?#7_16: IC?#7.16(Q6) LED?#166.K(C) LED?#167.K(C) LED?#168.K(C) LED?#169.K(C)
NetIC?#7_17: IC?#7.17(Q7) LED?#170.K(C) LED?#171.K(C) LED?#172.K(C)
NetLED?#1_A: LED?#1.A R?#2.1
NetLED?#2_A: LED?#2.A R?#3.1
NetLED?#3_A: LED?#3.A R?#4.1
NetLED?#4_A: LED?#4.A R?#5.1
NetLED?#5_A: LED?#5.A R?#6.1
NetLED?#6_A: LED?#6.A R?#7.1
NetLED?#7_A: LED?#7.A R?#8.1
NetLED?#8_A: LED?#8.A R?#9.1
NetLED?#9_A: LED?#9.A R?#10.1
NetLED?#10_A: LED?#10.A R?#11.1
NetLED?#11_A: LED?#11.A R?#12.1
NetLED?#12_A: LED?#12.A R?#13.1
NetLED?#13_A: LED?#13.A R?#14.1
NetLED?#14_A: LED?#14.A R?#15.1
NetLED?#15_A: LED?#15.A R?#16.1
NetLED?#16_A: LED?#16.A R?#17.1
NetLED?#17_A: LED?#17.A R?#18.1
NetLED?#18_A: LED?#18.A R?#19.1
NetLED?#19_A: LED?#19.A R?#20.1
NetLED?#20_A: LED?#20.A R?#21.1
NetLED?#21_A: LED?#21.A R?#22.1
NetLED?#22_A: LED?#22.A R?#23.1
NetLED?#23_A: LED?#23.A R?#24.1
NetLED?#24_A: LED?#24.A R?#25.1
NetLED?#25_A: LED?#25.A R?#26.1
NetLED?#26_A: LED?#26.A R?#27.1
NetLED?#27_A: LED?#27.A R?#28.1
NetLED?#28_A: LED?#28.A R?#29.1
NetLED?#29_A: LED?#29.A R?#30.1
NetLED?#30_A: LED?#30.A R?#31.1
NetLED?#31_A: LED?#31.A R?#32.1
NetLED?#32_A: LED?#32.A R?#33.1
NetLED?#33_A: LED?#33.A R?#34.1
NetLED?#34_A: LED?#34.A R?#35.1
NetLED?#35_A: LED?#35.A R?#36.1
NetLED?#36_A: LED?#36.A R?#37.1
NetLED?#37_A: LED?#37.A R?#38.1
NetLED?#38_A: LED?#38.A R?#39.1
NetLED?#39_A: LED?#39.A R?#40.1
NetLED?#40_A: LED?#40.A R?#41.1
NetLED?#41_A: LED?#41.A R?#42.1
NetLED?#42_A: LED?#42.A R?#43.1
NetLED?#43_A: LED?#43.A R?#44.1
NetLED?#44_A: LED?#44.A R?#45.1
NetLED?#45_A: LED?#45.A R?#46.1
NetLED?#46_A: LED?#46.A R?#47.1
NetLED?#47_A: LED?#47.A R?#48.1
NetLED?#48_A: LED?#48.A R?#49.1
NetLED?#49_A: LED?#49.A R?#50.1
NetLED?#50_A: LED?#50.A R?#51.1
NetLED?#51_A: LED?#51.A R?#52.1
NetLED?#52_A: LED?#52.A R?#53.1
NetLED?#53_A: LED?#53.A R?#54.1
NetLED?#54_A: LED?#54.A R?#55.1
NetLED?#55_A: LED?#55.A R?#56.1
NetLED?#56_A: LED?#56.A R?#57.1
NetLED?#57_A: LED?#57.A R?#58.1
NetLED?#58_A: LED?#58.A R?#59.1
NetLED?#59_A: LED?#59.A R?#60.1
NetLED?#60_A: LED?#60.A R?#61.1
NetLED?#61_A: LED?#61.A R?#62.1
NetLED?#62_A: LED?#62.A R?#63.1
NetLED?#63_A: LED?#63.A R?#64.1
NetLED?#64_A: LED?#64.A R?#65.1
NetLED?#65_A: LED?#65.A R?#66.1
NetLED?#66_A: LED?#66.A R?#67.1
NetLED?#67_A: LED?#67.A R?#68.1
NetLED?#68_A: LED?#68.A R?#69.1
NetLED?#69_A: LED?#69.A R?#70.1
NetLED?#70_A: LED?#70.A R?#71.1
NetLED?#71_A: LED?#71.A R?#72.1
NetLED?#72_A: LED?#72.A R?#73.1
NetLED?#73_A: LED?#73.A R?#74.1
NetLED?#74_A: LED?#74.A R?#75.1
NetLED?#75_A: LED?#75.A R?#76.1
NetLED?#76_A: LED?#76.A R?#77.1
NetLED?#77_A: LED?#77.A R?#78.1
NetLED?#78_A: LED?#78.A R?#79.1
NetLED?#79_A: LED?#79.A R?#80.1
NetLED?#80_A: LED?#80.A R?#81.1
NetLED?#81_A: LED?#81.A R?#82.1
NetLED?#82_A: LED?#82.A R?#83.1
NetLED?#83_A: LED?#83.A R?#84.1
NetLED?#84_A: LED?#84.A R?#85.1
NetLED?#85_A: LED?#85.A R?#86.1
NetLED?#86_A: LED?#86.A R?#87.1
NetLED?#87_A: LED?#87.A R?#88.1
NetLED?#88_A: LED?#88.A R?#91.1
NetLED?#89_A: LED?#89.A R?#92.1
NetLED?#90_A: LED?#90.A R?#93.1
NetLED?#91_A: LED?#91.A R?#94.1
NetLED?#92_A: LED?#92.A R?#95.1
NetLED?#93_A: LED?#93.A R?#96.1
NetLED?#94_A: LED?#94.A R?#97.1
NetLED?#95_A: LED?#95.A R?#98.1
NetLED?#96_A: LED?#96.A R?#99.1
NetLED?#97_A: LED?#97.A R?#100.1
NetLED?#98_A: LED?#98.A R?#101.1
NetLED?#99_A: LED?#99.A R?#102.1
NetLED?#100_A: LED?#100.A R?#103.1
NetLED?#101_A: LED?#101.A R?#104.1
NetLED?#102_A: LED?#102.A R?#105.1
NetLED?#103_A: LED?#103.A R?#106.1
NetLED?#104_A: LED?#104.A R?#107.1
NetLED?#105_A: LED?#105.A R?#108.1
NetLED?#106_A: LED?#106.A R?#109.1
NetLED?#107_A: LED?#107.A R?#110.1
NetLED?#108_A: LED?#108.A R?#111.1
NetLED?#109_A: LED?#109.A R?#112.1
NetLED?#110_A: LED?#110.A R?#113.1
NetLED?#111_A: LED?#111.A R?#114.1
NetLED?#112_A: LED?#112.A R?#115.1
NetLED?#113_A: LED?#113.A R?#116.1
NetLED?#114_A: LED?#114.A R?#117.1
NetLED?#115_A: LED?#115.A R?#118.1
NetLED?#116_A: LED?#116.A R?#119.1
NetLED?#117_A: LED?#117.A R?#120.1
NetLED?#118_A: LED?#118.A R?#121.1
NetLED?#119_A: LED?#119.A R?#122.1
NetLED?#120_A: LED?#120.A R?#123.1
NetLED?#121_A: LED?#121.A R?#124.1
NetLED?#122_A: LED?#122.A R?#125.1
NetLED?#123_A: LED?#123.A R?#126.1
NetLED?#124_A: LED?#124.A R?#127.1
NetLED?#125_A: LED?#125.A R?#128.1
NetLED?#126_A: LED?#126.A R?#129.1
NetLED?#127_A: LED?#127.A R?#130.1
NetLED?#128_A: LED?#128.A R?#131.1
NetLED?#129_A: LED?#129.A R?#132.1
NetLED?#130_A: LED?#130.A R?#133.1
NetLED?#131_A: LED?#131.A R?#134.1
NetLED?#132_A: LED?#132.A R?#135.1
NetLED?#133_A: LED?#133.A R?#136.1
NetLED?#134_A: LED?#134.A R?#137.1
NetLED?#135_A: LED?#135.A R?#138.1
NetLED?#136_A: LED?#136.A R?#139.1
NetLED?#137_A: LED?#137.A R?#140.1
NetLED?#138_A: LED?#138.A R?#141.1
NetLED?#139_A: LED?#139.A R?#142.1
NetLED?#140_A: LED?#140.A R?#143.1
NetLED?#141_A: LED?#141.A R?#144.1
NetLED?#142_A: LED?#142.A R?#145.1
NetLED?#143_A: LED?#143.A R?#146.1
NetLED?#144_A: LED?#144.A R?#147.1
NetLED?#145_A: LED?#145.A R?#148.1
NetLED?#146_A: LED?#146.A R?#149.1
NetLED?#147_A: LED?#147.A R?#150.1
NetLED?#148_A: LED?#148.A R?#151.1
NetLED?#149_A: LED?#149.A R?#152.1
NetLED?#150_A: LED?#150.A R?#153.1
NetLED?#151_A: LED?#151.A R?#154.1
NetLED?#152_A: LED?#152.A R?#155.1
NetLED?#153_A: LED?#153.A R?#156.1
NetLED?#154_A: LED?#154.A R?#157.1
NetLED?#155_A: LED?#155.A R?#158.1
NetLED?#156_A: LED?#156.A R?#159.1
NetLED?#157_A: LED?#157.A R?#160.1
NetLED?#158_A: LED?#158.A R?#161.1
NetLED?#159_A: LED?#159.A R?#162.1
NetLED?#160_A: LED?#160.A R?#163.1
NetLED?#161_A: LED?#161.A R?#164.1
NetLED?#162_A: LED?#162.A R?#165.1
NetLED?#163_A: LED?#163.A R?#166.1
NetLED?#164_A: LED?#164.A R?#167.1
NetLED?#165_A: LED?#165.A R?#168.1
NetLED?#166_A: LED?#166.A R?#169.1
NetLED?#167_A: LED?#167.A R?#170.1
NetLED?#168_A: LED?#168.A R?#171.1
NetLED?#169_A: LED?#169.A R?#172.1
NetLED?#170_A: LED?#170.A R?#173.1
NetLED?#171_A: LED?#171.A R?#174.1
NetLED?#172_A: LED?#172.A R?#175.1
NetLED_A: LED.A R?#1.1

Not connected (* = marked no-connect by the designer): ? 1(32KHZ) 3(INT) 4(RST) 5(P$1) 6(P$2) 7(P$3) 8(P$4) 9(P$5) 10(P$6) 11(P$7) 12(P$8) 14(VBAT); IC?#1 12(RCK) 18(DO); IC?#2 12(RCK); IC?#3 1(RESET) 20(AVCC) 21(AREF) 22(AGND); ICSP 5; IOH 7 8

## Notes on the sheet
- (near IOH) SDA
- (near IOH) SCL
- (near IOH) 12
- (near IOH) 13
- (near IOH) 8
- (near IOH) 9
- (near IOH) 10
- (near IOH) 11
- (near IOL) 4
- (near IOL) 5
- (near IOL) 6
- (near IOL) 7
- (near IOL) 0
- (near IOL) 1
- (near IOL) 2
- (near IOL) 3
- Labels drawn without touching a wire or pin: "BIRTH (blue)", "BIRTH (green)", "BIRTH (red)", "DAY (blue)", "DAY (green)", "DAY (red)", "EIGHT", "ELE", "FIVE", "FOUR", "HALF", "HAPPY (blue)", "HAPPY (green)", "HAPPY (red)", "I", "IS", "LEXIE (blue)", "LEXIE (green)", "LEXIE (red)", "LOVE (blue)", "LOVE (green)", "LOVE (red)", "LVE", "MIN", "NINE", "NTY", "OCK", "OCL", "ONE", "PAST", "QUA", "RTER", "SEVEN", "SIX", "T", "TEN", "THREE", "TO", "TWE", "TWO", "UTES", "VEN", "YOU (blue)", "YOU (green)", "YOU (red)", XTAL1

## Library data of the parts
AD = PINHD-1X6: <b>PIN HEADER</b>
IC?#3 = ATMEGA328P-PU
ICSP = PINHD-2X3: <b>PIN HEADER</b>
IOH = PINHD-1X10_ARD: <b>PIN HEADER</b>
IOL = PINHD-1X8: <b>PIN HEADER</b>
R?#1-R?#175 = Res1: Resistor; Published: 8-Jun-2000; LatestRevisionDate: 17-Jul-2002; LatestRevisionNote: Re-released for DXP Platform.; PackageReference: AXIAL-0.3; Publisher: Altium Limited; PackageDescription: Axial Device, Thru-Hole; 2 Leads; 0.3 in Pin Spacing
S?#1 S?#2 = SW-SPST: Single-Pole, Single-Throw Switch; Published: 24-Mar-1999; LatestRevisionDate: 17-Jul-2002; LatestRevisionNote: Re-released for DXP Platform.; PackageReference: SPST-2; Publisher: Altium Limited; PackageDescription: Switch; 2 Leads
Y2 = RESONATORMU